# Altium schematic sheet Raspberry PI.SchDoc
size A3; SheetNumber: 5; SheetTotal: 7
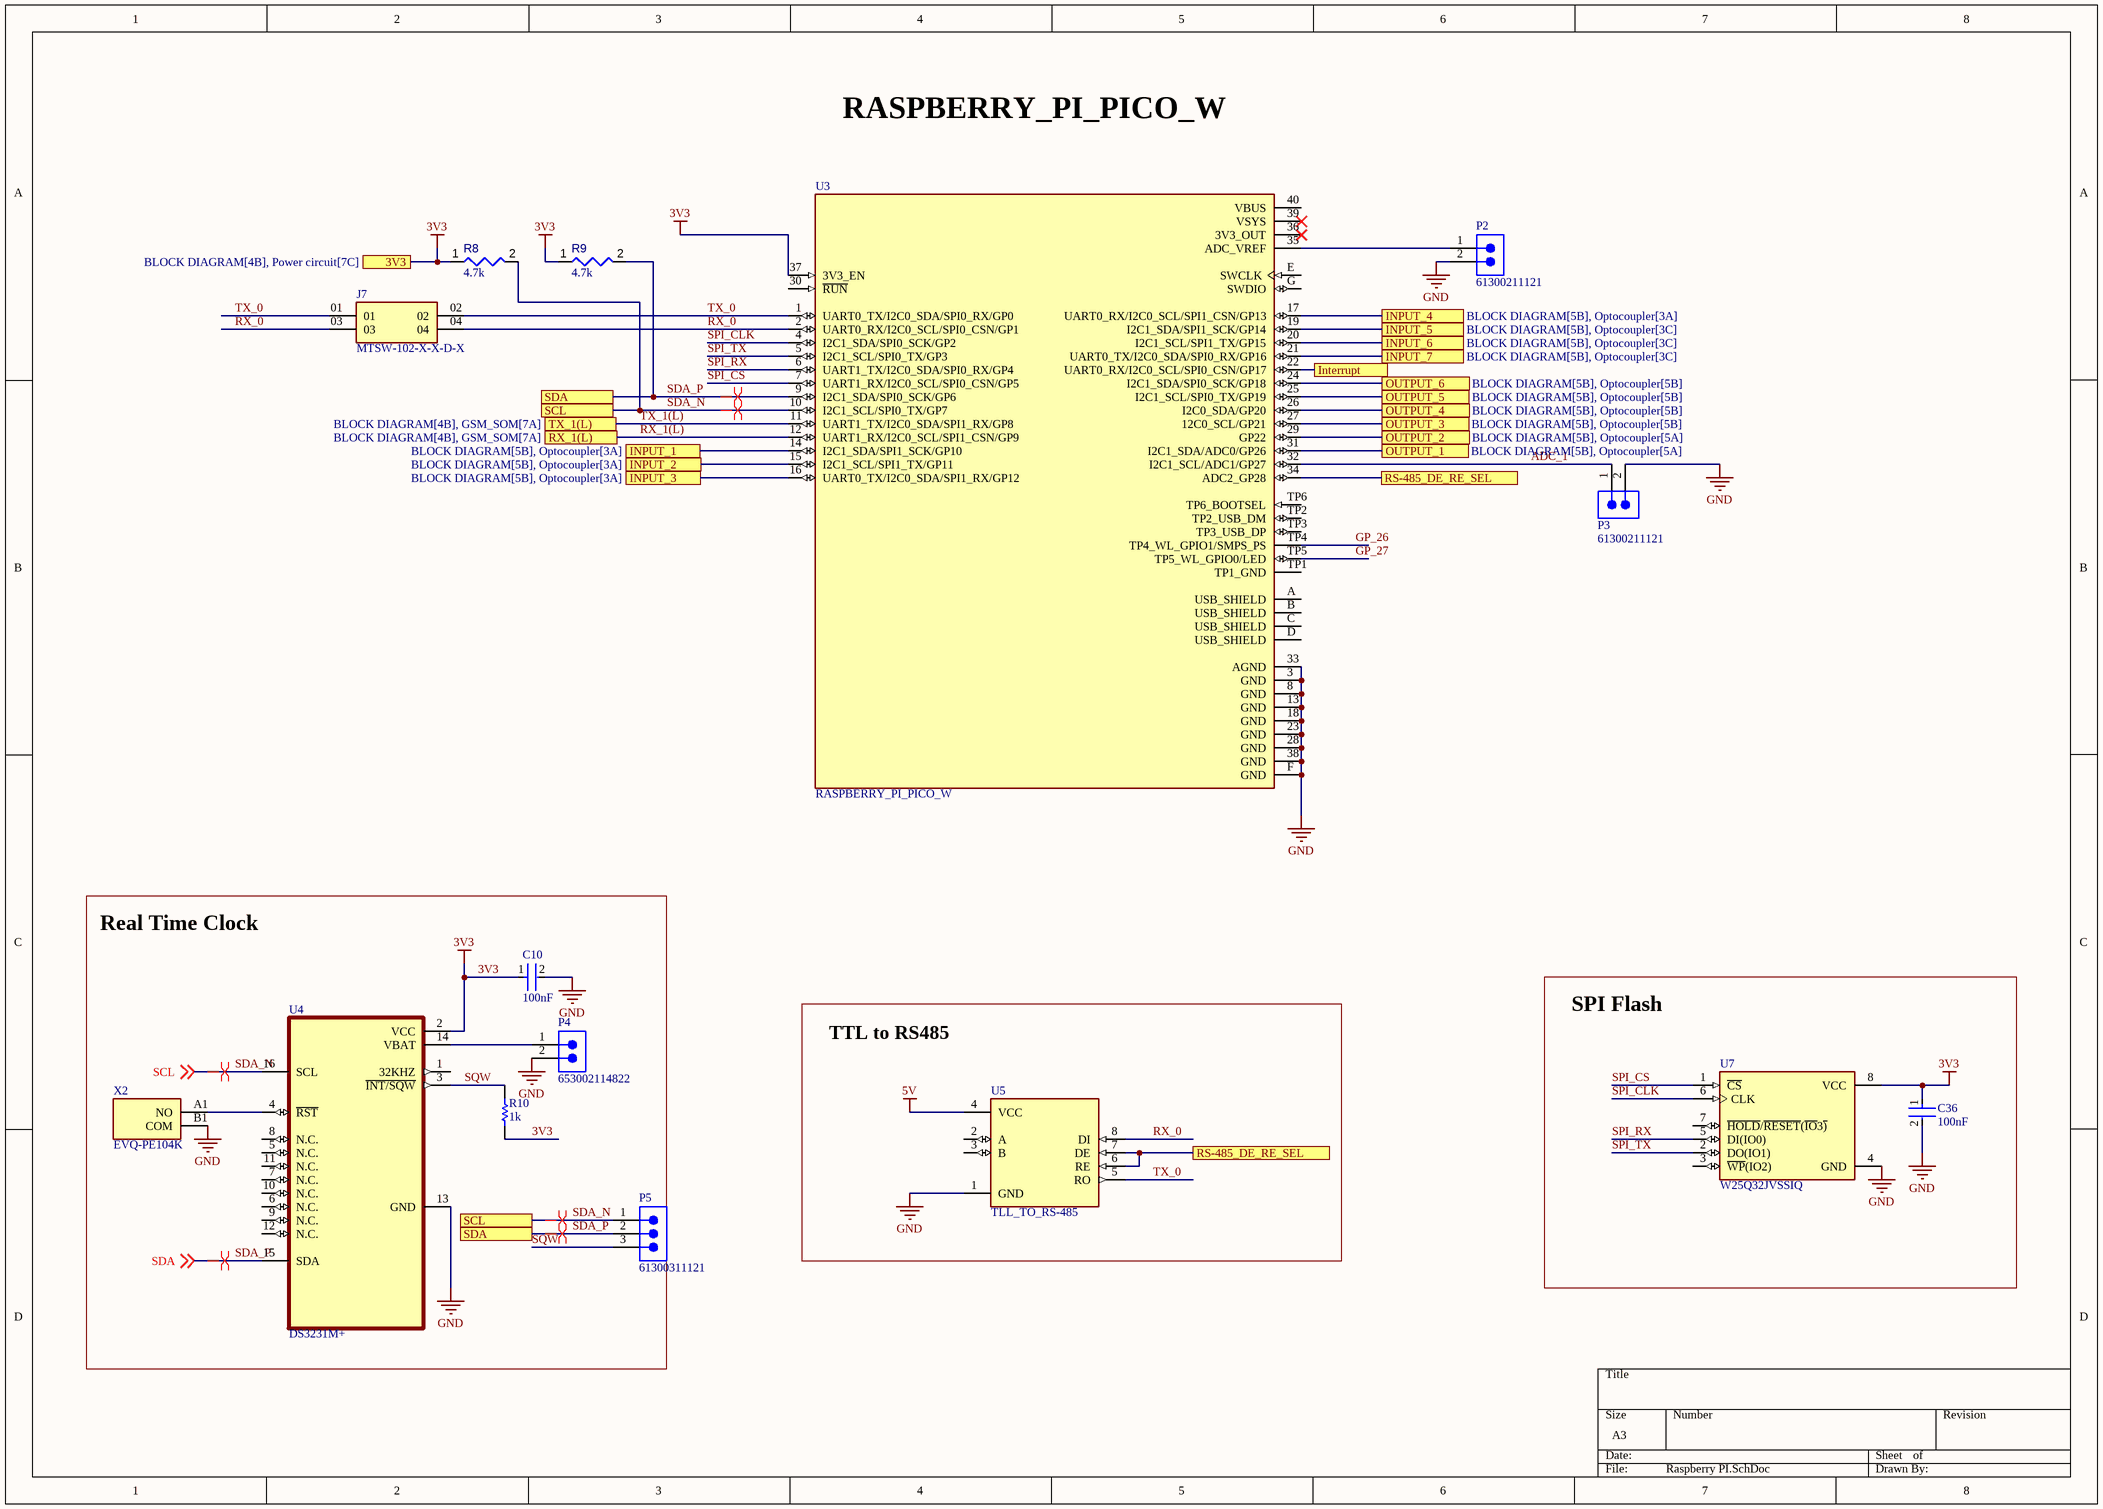
[diagram p0: Raspberry PI.SchDoc]

## Parts
C10  100nF  [FP-C0402-BB-MFG]
C36  100nF  [FP-C0402-BB-MFG]
J7  MTSW-102-X-X-D-X  [SAMTEC_MTSW-102-X-X-D-X]
P2  61300211121  [61300211121]
P3  61300211121  [61300211121]
P4  653002114822  [653002114822]
P5  61300311121  [61300311121]
R8  value 4.7k  [RESC1005X40X25ML05T05]  (hidden comment: Resistor 4k7 +/-1% 0402 100 mW)
R9  value 4.7k  [RESC1005X40X25ML05T05]  (hidden comment: Resistor 4k7 +/-1% 0402 100 mW)
R10  value 1k  [RESC1005X40X25ML05T05]  (hidden comment: Resistor 1k +/-1% 0402 100 mW)
U3  RASPBERRY_PI_PICO_W  [MODULE_RASPBERRY_PI_PICO_W]
U4  DS3231M+  [SOIC127P1032X265-16N]
U5  TLL_TO_RS-485  [MODULE_MAX485_MODULE_5V_LOGIC_TLL_TO_RS-485_CONVERTER]
U7  W25Q32JVSSIQ  [SOIC127P790X216-8N]
X2  EVQ-PE104K  [EVQPE104K]

## Blocks framed on the sheet
Real Time Clock: C10 P4 P5 R10 U4 X2
SPI Flash: C36 U7
TTL to RS485: U5

## Ports
3V3 (see BLOCK DIAGRAM[4B], Power circuit[7C]), INPUT_1 (see BLOCK DIAGRAM[5B], Optocoupler[3A]), INPUT_2 (see BLOCK DIAGRAM[5B], Optocoupler[3A]), INPUT_3 (see BLOCK DIAGRAM[5B], Optocoupler[3A]), INPUT_4 (see BLOCK DIAGRAM[5B], Optocoupler[3A]), INPUT_5 (see BLOCK DIAGRAM[5B], Optocoupler[3C]), INPUT_6 (see BLOCK DIAGRAM[5B], Optocoupler[3C]), INPUT_7 (see BLOCK DIAGRAM[5B], Optocoupler[3C]), Interrupt, OUTPUT_1 (see BLOCK DIAGRAM[5B], Optocoupler[5A]), OUTPUT_2 (see BLOCK DIAGRAM[5B], Optocoupler[5A]), OUTPUT_3 (see BLOCK DIAGRAM[5B], Optocoupler[5B]), OUTPUT_4 (see BLOCK DIAGRAM[5B], Optocoupler[5B]), OUTPUT_5 (see BLOCK DIAGRAM[5B], Optocoupler[5B]), OUTPUT_6 (see BLOCK DIAGRAM[5B], Optocoupler[5B]), RS-485_DE_RE_SEL, RX_1(L) (see BLOCK DIAGRAM[4B], GSM_SOM[7A]), SCL, SDA, TX_1(L) (see BLOCK DIAGRAM[4B], GSM_SOM[7A])

## Nets
3V3: C10.1 C36.1 R8.1 R9.1 R10.2 U3.37(3V3_EN) U4.2(VCC) U7.8(VCC) ; port 3V3
5V: U5.4(VCC)
GND: C10.2 C36.2 P2.2 P3.2 P4.2 U3.3(GND) U3.8(GND) U3.13(GND) U3.18(GND) U3.23(GND) U3.28(GND) U3.33(AGND) U3.38(GND) U3.F(GND) U4.13(GND) U5.1(GND) U7.4(GND) X2.B1(COM)
ADC_1: P3.1 U3.32(I2C1_SCL/ADC1/GP27)
GP_26: U3.TP4(TP4_WL_GPIO1/SMPS_PS)
GP_27: U3.TP5(TP5_WL_GPIO0/LED)
INPUT_1: U3.14(I2C1_SDA/SPI1_SCK/GP10) ; port INPUT_1
INPUT_2: U3.15(I2C1_SCL/SPI1_TX/GP11) ; port INPUT_2
INPUT_3: U3.16(UART0_TX/I2C0_SDA/SPI1_RX/GP12) ; port INPUT_3
INPUT_4: U3.17(UART0_RX/I2C0_SCL/SPI1_CSN/GP13) ; port INPUT_4
INPUT_5: U3.19(I2C1_SDA/SPI1_SCK/GP14) ; port INPUT_5
INPUT_6: U3.20(I2C1_SCL/SPI1_TX/GP15) ; port INPUT_6
INPUT_7: U3.21(UART0_TX/I2C0_SDA/SPI0_RX/GP16) ; port INPUT_7
Interrupt: U3.22(UART0_RX/I2C0_SCL/SPI0_CSN/GP17) ; port Interrupt
OUTPUT_1: U3.31(I2C1_SDA/ADC0/GP26) ; port OUTPUT_1
OUTPUT_2: U3.29(GP22) ; port OUTPUT_2
OUTPUT_3: U3.27(12C0_SCL/GP21) ; port OUTPUT_3
OUTPUT_4: U3.26(I2C0_SDA/GP20) ; port OUTPUT_4
OUTPUT_5: U3.25(I2C1_SCL/SPI0_TX/GP19) ; port OUTPUT_5
OUTPUT_6: U3.24(I2C1_SDA/SPI0_SCK/GP18) ; port OUTPUT_6
RS-485_DE_RE_SEL: U3.34(ADC2_GP28) U5.6(RE) U5.7(DE) ; port RS-485_DE_RE_SEL
RX_0: J7.03 J7.04 U3.2(UART0_RX/I2C0_SCL/SPI0_CSN/GP1) U5.8(DI)
RX_1(L): U3.12(UART1_RX/I2C0_SCL/SPI1_CSN/GP9) ; port RX_1(L)
SDA_N: P5.1 R8.2 U3.10(I2C1_SCL/SPI0_TX/GP7) U4.16(SCL) ; off-sheet SCL, port SCL  [also labelled SCL]
SDA_P: P5.2 R9.2 U3.9(I2C1_SDA/SPI0_SCK/GP6) U4.15(SDA) ; off-sheet SDA, port SDA  [also labelled SDA]
SPI_CLK: U3.4(I2C1_SDA/SPI0_SCK/GP2) U7.6(CLK)
SPI_CS: U3.7(UART1_RX/I2C0_SCL/SPI0_CSN/GP5) U7.1(~{CS})
SPI_RX: U3.6(UART1_TX/I2C0_SDA/SPI0_RX/GP4) U7.5(DI(IO0))
SPI_TX: U3.5(I2C1_SCL/SPI0_TX/GP3) U7.2(DO(IO1))
SQW: P5.3 R10.1 U4.3(~{INT/SQW})
TX_0: J7.01 J7.02 U3.1(UART0_TX/I2C0_SDA/SPI0_RX/GP0) U5.5(RO)
TX_1(L): U3.11(UART1_TX/I2C0_SDA/SPI1_RX/GP8) ; port TX_1(L)
NetP2_1: P2.1 U3.35(ADC_VREF)
NetP4_1: P4.1 U4.14(VBAT)
NetU4_4: U4.4(~{RST}) X2.A1(NO)

Not connected (* = marked no-connect by the designer): U3 30(~{RUN}) 36(3V3_OUT)* 39(VSYS)* 40(VBUS) A(USB_SHIELD) B(USB_SHIELD) C(USB_SHIELD) D(USB_SHIELD) E(SWCLK) G(SWDIO) TP1(TP1_GND) TP2(TP2_USB_DM) TP3(TP3_USB_DP) TP6(TP6_BOOTSEL); U4 1(32KHZ) 5(N.C.) 6(N.C.) 7(N.C.) 8(N.C.) 9(N.C.) 10(N.C.) 11(N.C.) 12(N.C.); U5 2(A) 3(B); U7 3(~{WP}(IO2)) 7(~{HOLD}/~{RESET}(~{IO}3~{)})

## Layout directives
differential pair: SDA_N, SDA_P

## Notes on the sheet
- RASPBERRY_PI_PICO_W

## Library data of the parts
C10 C36 = CMP-2008-02046-2: CAP CER 0.1UF 10V X5R 0402; Manufacturer: Kemet; Manufacturer Part Number: C0402C104K8PACTU; Material: Ceramic; Capacitance: 0.10 μF; Temperature Coefficient: 15%; Tolerance: 0.1; Value: 0.10 μF; Package: C0402-BB; Temperature: -55°C to +125°C; ComponentLink2Description: Datasheet; Temperature Characteristic: X5R; Device Class L1: Passive Components; Height: 0.55mm; Lead Free: Yes; ComponentLink2URL: https://content.kemet.com/datasheets/KEM_C1002_X7R_SMD.pdf; Device Class L2: Capacitors; Temperature Range Low: -55°C; Temperature Range High: +125°C; RoHS: TRUE; Octopart: https://octopart.com/c0402c104k8pactu-kemet-140039; Automotive: No; Mouser Description: Capacitor 100 nF 10 VDC 0402; Category: Cap; Voltage Rating: 10 V; Digikey Description: CAP CER 0.1UF 10V X5R 0402; Ipc Land Pattern Name: CAPC10050X50; Device Class L3: Ceramic Capacitors
J7 = MTSW-102-X-X-D-X: MF: Samtec; Package: None; Price: None; Value: *; MP: MTSW-102-X-X-D-X; Availability: Unavailable
P2 P3 = CMP-1712-00002-6: NexarPartId: 20081794; Number of Contacts: 2; Pitch: 2.54mm; Connector Type: Male Pin; Voltage Rating: 250V; Current Rating: 3A; Gender: Male; Contact Resistance: 20mΩ; Height: 8.94mm; Lead Free: Lead Free; Number of Pins: 2; Termination: Through Hole; RoHS: Compliant; Lead Pitch: 2.54mm; REACH SVHC: No SVHC; Housing Material: PBT; Contact Mating Length: 5.9944mm; Min Operating Temperature: -40°C; Orientation: Vertical; Contact Material: Copper; Contact Gender: Male; Max Operating Temperature: 125°C; Number of Rows: 1; Number of Positions: 2; Packaging: Bulk; Contact Plating: Gold; Mount: Through Hole; Color: Black; Operating Supply Voltage: 250V
P4 = CMP-1502-00739-2: NexarPartId: 116856437; Insulation Resistance: 100MΩ; Current Rating: 1A; Pitch: 1.25mm; Gender: Male; Number of Pins: 2; Min Operating Temperature: -40°C; Length: 4.25mm; Max Operating Temperature: 85°C; Contact Plating: Tin; RoHS: Compliant
P5 = CMP-1502-01062-3: NexarPartId: 32855521; Current Rating: 3A; Voltage Rating: 250V; Number of Positions: 3; Pitch: 2.54mm; Contact Resistance: 20mΩ; Connector Type: Male Pin; Gender: Male; REACH SVHC: Unknown; Packaging: Bulk; Contact Material: Copper; Min Operating Temperature: -40°C; Number of Rows: 1; Orientation: Vertical; RoHS: Compliant; Contact Plating: Gold; Max Operating Temperature: 105°C; Mount: Through Hole; Height: 8.94mm; Operating Supply Voltage: 250V; Number of Pins: 3; Contact Mating Length: 5.9944mm; Number of Contacts: 3; Color: Black; Lead Free: Lead Free; Lead Pitch: 2.54mm; Termination: Solder
R8 R9 = CMP-009-00030-5: Chip Resistor, 4.7 KOhm, +/- 1%, 0.1 W, -55 to 155 degC, 0402 (1005 Metric); Power: 100mW; Voltage Rating: 50V; Mounting Technology: SM; RoHS Compliant: True; Tolerance: 1%; Min Operating Temperature: -55°C; Max Operating Temperature: 155°C; Case/Package: 0402; Pins: 2
R10 = CMP-009-00009-5: Chip Resistor, 1 KOhm, +/- 1%, 0.1 W, -55 to 155 degC, 0402 (1005 Metric); Power: 100mW; Voltage Rating: 50V; Min Operating Temperature: -55°C; Max Operating Temperature: 155°C; RoHS Compliant: True; Mounting Technology: SM; Pins: 2; Tolerance: 1%; Case/Package: 0402
U3 = RASPBERRY_PI_PICO_W: Raspberry Pi Board, Arm Cortex-M0+; Silicon Manufacturer:Raspberry Pi; No. Of Bits:32Bit; Silicon Family Name:-; Core Architecture:Arm; Core Sub-Architecture:Cortex-M0+; Silicon Core Number:Rp2040; Product Range:Raspberry Pi Pico Rohs Compliant: Yes |Raspberry-Pi RASPBERRY PI PICO W; SnapEDA_Link: https://www.snapeda.com/parts/RASPBERRY%20PI%20PICO%20W/Raspberry+Pi/view-part/?ref=snap; Package: None; Value: *; MF: Raspberry Pi; MP: RASPBERRY PI PICO W; Check_prices: https://www.snapeda.com/parts/RASPBERRY%20PI%20PICO%20W/Raspberry+Pi/view-part/?ref=eda
U4 = DS3231M+: Real Time Clock _RTC_ IC Clock/Calendar IÂ²C, 2-Wire Serial 8-SOIC _0.154, 3.90mm Width_; MF: Maxim Integrated; Availability: Unavailable; MP: DS3231M; Price: None; Value: *; SnapEDA_Link: https://www.snapeda.com/parts/DS3231M/Maxim%20Integrated/view-part/2748210/?ref=snap; Package: SOIC-8 Maxim Integrated
U5 = MAX485_MODULE_5V_LOGIC_TLL_TO_RS-485_CONVERTER: 5V MAX485 TTL To RS485 Converter Module Board for Arduino; MP: MAX485 Module 5V logic TLL to RS-485 converter; MF: e-Gizmo Mechatronix Central; Value: *; SnapEDA_Link: https://www.snapeda.com/parts/MAX485%20Module%205V%20logic%20TLL%20to%20RS-485%20converter/e-Gizmo+Mechatronix+Central/view-part/?ref=snap; Package: Package; Availability: Not in stock; Check_prices: https://www.snapeda.com/parts/MAX485%20Module%205V%20logic%20TLL%20to%20RS-485%20converter/e-Gizmo+Mechatronix+Central/view-part/?ref=eda; Price: None
U7 = W25Q32JVSSIQ: FLASH - NOR Memory IC 32Mb (4M x 8) SPI - Quad I/O 133 MHz 8-SOIC; MF: Winbond; SnapEDA_Link: https://www.snapeda.com/parts/W25Q32JVSSIQ/Winbond+Electronics/view-part/?ref=snap; Package: SOIC-8 Winbond; Value: *; MP: W25Q32JVSSIQ; Check_prices: https://www.snapeda.com/parts/W25Q32JVSSIQ/Winbond+Electronics/view-part/?ref=eda
X2 = EVQ-PE104K: Switch Tactile N.O. SPST Rectangular Button J-Bend 0.05A 12VDC 1N SMD T/R; Manufacturer_Name: Panasonic; Geometry.Height: 4.6mm; Mouser Part Number: 667-EVQ-PE104K; Mouser Price/Stock: https://www.mouser.co.uk/ProductDetail/Panasonic/EVQ-PE104K?qs=wX5mvoJE4NGLiYsCBZAptQ%3D%3D; Manufacturer_Part_Number: EVQ-PE104K; Datasheet Link: https://industrial.panasonic.com/cdbs/www-data/pdf/ATK0000/ATK0000C376.pdf